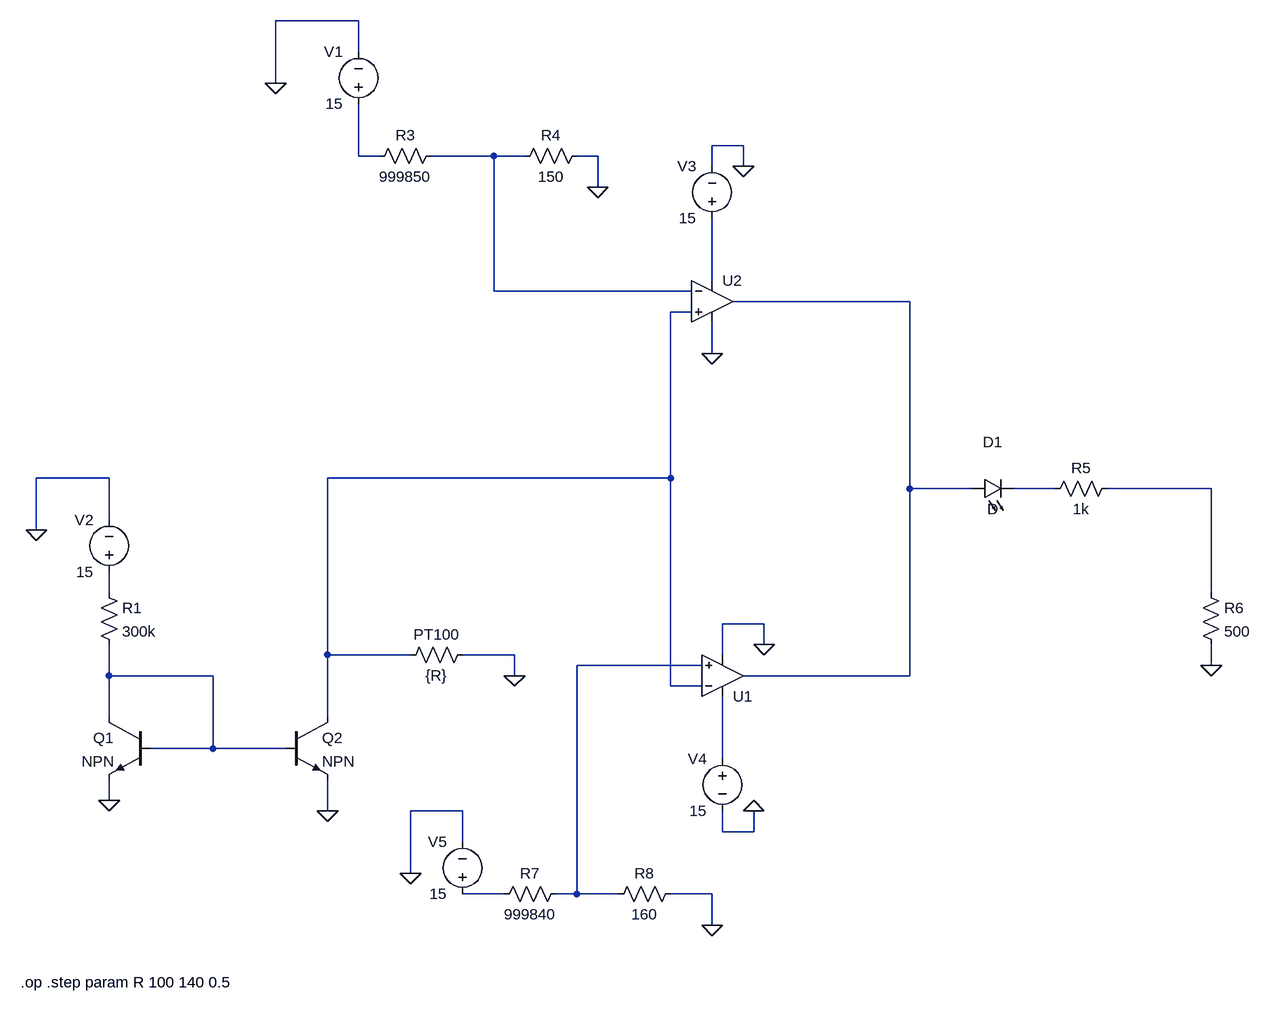
[diagram p0: schematic problem2.asc]
problem2.asc, the LTspice schematic file:
Version 4
SHEET 1 1732 1204
WIRE 48 -432 -80 -432
WIRE 48 -384 48 -432
WIRE -80 -336 -80 -432
WIRE 640 -240 592 -240
WIRE 48 -224 48 -304
WIRE 80 -224 48 -224
WIRE 256 -224 160 -224
WIRE 304 -224 256 -224
WIRE 416 -224 384 -224
WIRE 592 -208 592 -240
WIRE 640 -208 640 -240
WIRE 416 -176 416 -224
WIRE 592 -32 592 -128
WIRE 256 -16 256 -224
WIRE 560 -16 256 -16
WIRE 896 0 624 0
WIRE 560 16 528 16
WIRE 592 80 592 32
WIRE -336 272 -448 272
WIRE 528 272 528 16
WIRE 528 272 0 272
WIRE 896 288 896 0
WIRE 992 288 896 288
WIRE 1120 288 1056 288
WIRE 1360 288 1200 288
WIRE -336 336 -336 272
WIRE -448 352 -448 272
WIRE -336 448 -336 416
WIRE 1360 448 1360 288
WIRE 672 496 608 496
WIRE 672 528 672 496
WIRE 0 544 0 272
WIRE 128 544 0 544
WIRE 288 544 208 544
WIRE 608 544 608 496
WIRE 576 560 384 560
WIRE 1360 560 1360 528
WIRE -336 576 -336 528
WIRE -176 576 -336 576
WIRE 288 576 288 544
WIRE 896 576 896 288
WIRE 896 576 640 576
WIRE 528 592 528 272
WIRE 576 592 528 592
WIRE -336 640 -336 576
WIRE 0 640 0 544
WIRE -176 688 -176 576
WIRE -176 688 -272 688
WIRE -64 688 -176 688
WIRE 608 704 608 608
WIRE -336 768 -336 736
WIRE 0 784 0 736
WIRE 208 784 128 784
WIRE 608 816 608 784
WIRE 656 816 656 784
WIRE 656 816 608 816
WIRE 208 832 208 784
WIRE 128 880 128 784
WIRE 272 912 208 912
WIRE 384 912 384 560
WIRE 384 912 352 912
WIRE 448 912 384 912
WIRE 592 912 528 912
WIRE 592 960 592 912
FLAG -336 768 0
FLAG 0 784 0
FLAG 416 -176 0
FLAG -80 -336 0
FLAG -448 352 0
FLAG 1360 560 0
FLAG 592 80 0
FLAG 640 -208 0
FLAG 288 576 0
FLAG 656 784 0
FLAG 672 528 0
FLAG 592 960 0
FLAG 128 880 0
SYMBOL npn -272 640 M0
SYMATTR InstName Q1
SYMBOL npn -64 640 R0
SYMATTR InstName Q2
SYMBOL res -352 432 R0
SYMATTR InstName R1
SYMATTR Value 300k
SYMBOL res 176 -240 R90
WINDOW 0 0 56 VBottom 2
WINDOW 3 32 56 VTop 2
SYMATTR InstName R3
SYMATTR Value 999850
SYMBOL res 400 -240 R90
WINDOW 0 0 56 VBottom 2
WINDOW 3 32 56 VTop 2
SYMATTR InstName R4
SYMATTR Value 150
SYMBOL res 1216 272 R90
WINDOW 0 0 56 VBottom 2
WINDOW 3 32 56 VTop 2
SYMATTR InstName R5
SYMATTR Value 1k
SYMBOL res 1344 432 R0
SYMATTR InstName R6
SYMATTR Value 500
SYMBOL voltage 48 -288 R180
WINDOW 0 24 96 Left 2
WINDOW 3 24 16 Left 2
SYMATTR InstName V1
SYMATTR Value 15
SYMBOL voltage -336 432 R180
WINDOW 0 24 96 Left 2
WINDOW 3 24 16 Left 2
SYMATTR InstName V2
SYMATTR Value 15
SYMBOL voltage 592 -112 R180
WINDOW 0 24 96 Left 2
WINDOW 3 24 16 Left 2
SYMATTR InstName V3
SYMATTR Value 15
SYMBOL OpAmps\\UniversalOpamp2 592 0 R0
SYMATTR InstName U2
SYMBOL voltage 608 688 M0
SYMATTR InstName V4
SYMATTR Value 15
SYMBOL OpAmps\\UniversalOpamp2 608 576 M180
SYMATTR InstName U1
SYMBOL res 368 896 R90
WINDOW 0 0 56 VBottom 2
WINDOW 3 32 56 VTop 2
SYMATTR InstName R7
SYMATTR Value 999840
SYMBOL res 544 896 R90
WINDOW 0 0 56 VBottom 2
WINDOW 3 32 56 VTop 2
SYMATTR InstName R8
SYMATTR Value 160
SYMBOL voltage 208 928 R180
WINDOW 0 24 96 Left 2
WINDOW 3 24 16 Left 2
SYMATTR InstName V5
SYMATTR Value 15
SYMBOL res 224 528 R90
WINDOW 0 0 56 VBottom 2
WINDOW 3 32 56 VTop 2
SYMATTR InstName PT100
SYMATTR Value {R}
SYMBOL LED 992 304 R270
WINDOW 0 72 32 VTop 2
WINDOW 3 0 32 VBottom 2
SYMATTR InstName D1
TEXT -432 1048 Left 2 !.step param R 100 140 0.5
TEXT -472 1048 Left 2 !.op

The netlist it stands for:
* problem2.asc
Q1 N010 N010 0 0 NPN
Q2 N005 N010 0 0 NPN
R1 N008 N010 300k
R3 N002 N001 999850
R4 0 N002 150
R5 N007 N006 1k
R6 N007 0 500
V1 N001 0 15
V2 N008 0 15
V3 N003 0 15
XU2 N005 N002 N003 0 N004 level.2 Avol=1Meg GBW=10Meg Slew=10Meg ilimit=25m rail=0 Vos=0 phimargin=45 en=0 enk=0 in=0 ink=0 Rin=500Meg  ; pins IN+ IN- V+ V- OUT
V4 N011 0 15
XU1 N009 N005 N011 0 N004 level.2 Avol=1Meg GBW=10Meg Slew=10Meg ilimit=25m rail=0 Vos=0 phimargin=45 en=0 enk=0 in=0 ink=0 Rin=500Meg  ; pins IN+ IN- V+ V- OUT
R7 N009 N012 999840
R8 0 N009 160
V5 N012 0 15
R§PT100 0 N005 {R}
D1 N004 N006 D
.model D D
.lib standard.dio
.model NPN NPN
.model PNP PNP
.lib standard.bjt
.step param R 100 140 0.5
.op
.lib UniversalOpamps2.sub
.backanno
.end